# EAGLE design USBtoSPI (EAGLE 6.2)
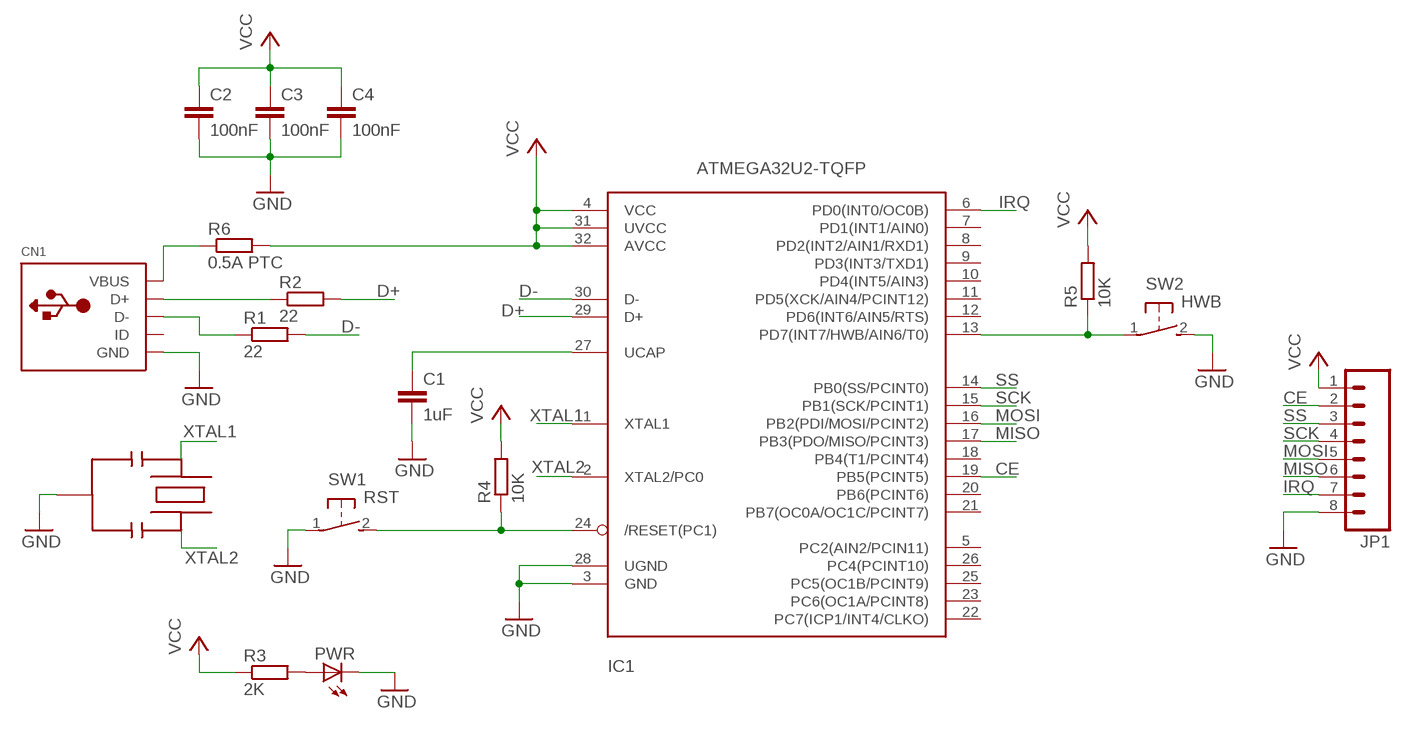
[diagram p0: schematic, sheet 1]

## Parts
C1  1uF  C-EUC0603  [C0603]
C2  100nF  C-EUC0603  [C0603]
C3  100nF  C-EUC0603  [C0603]
C4  100nF  C-EUC0603  [C0603]
CN1  USBMINIB  [USB-MINIB]
IC1  ATMEGA32U2-TQFP  [TQFP32-08]
JP1  M081X08  [1X08]
PWR  LEDCHIP-LED0603  [CHIP-LED0603]
R1  22  R-EU_R0603  [R0603]
R2  22  R-EU_R0603  [R0603]
R3  2K  R-EU_R0603  [R0603]
R4  10K  R-EU_R0603  [R0603]
R5  10K  R-EU_R0603  [R0603]
R6  0.5A PTC  R-EU_R1210  [R1210]
SW1  RST  SMD-TACT-3.9X2.9  [SMD-TACT-3.9X2.9]
SW2  HWB  SMD-TACT-3.9X2.9  [SMD-TACT-3.9X2.9]
U$1  SMDRESONATORPBRC-H  [SMDRESONATOR]

## Nets
CE: IC1.19(PB5(PCINT5)) JP1.2
D+: IC1.29(D+) R2.2
D-: IC1.30(D-) R1.2
GND: C1.2 C2.2 C3.2 C4.2 CN1.GND IC1.3(GND) IC1.28(UGND) JP1.8 PWR.C SW1.1 SW2.2 U$1.P$1
IRQ: IC1.6(PD0(INT0/OC0B)) JP1.7
MISO: IC1.17(PB3(PDO/MISO/PCINT3)) JP1.6
MOSI: IC1.16(PB2(PDI/MOSI/PCINT2)) JP1.5
N$1: CN1.D- R1.1
N$2: CN1.D+ R2.1
N$3: C1.1 IC1.27(UCAP)
N$4: IC1.24(/RESET(PC1)) R4.1 SW1.2
N$5: IC1.13(PD7(INT7/HWB/AIN6/T0)) R5.1 SW2.1
N$6: PWR.A R3.2
N$7: CN1.VBUS R6.1
SCK: IC1.15(PB1(SCK/PCINT1)) JP1.4
SS: IC1.14(PB0(SS/PCINT0)) JP1.3
VCC: C2.1 C3.1 C4.1 IC1.4(VCC) IC1.31(UVCC) IC1.32(AVCC) JP1.1 R3.1 R4.2 R5.2 R6.2
XTAL1: IC1.1(XTAL1) U$1.P$2
XTAL2: IC1.2(XTAL2/PC0) U$1.P$3
Unconnected: CN1.ID IC1.5(PC2(AIN2/PCIN11)) IC1.7(PD1(INT1/AIN0)) IC1.8(PD2(INT2/AIN1/RXD1)) IC1.9(PD3(INT3/TXD1)) IC1.10(PD4(INT5/AIN3)) IC1.11(PD5(XCK/AIN4/PCINT12)) IC1.12(PD6(INT6/AIN5/RTS)) IC1.18(PB4(T1/PCINT4)) IC1.20(PB6(PCINT6)) IC1.21(PB7(OC0A/OC1C/PCINT7)) IC1.22(PC7(ICP1/INT4/CLKO)) IC1.23(PC6(OC1A/PCINT8)) IC1.25(PC5(OC1B/PCINT9)) IC1.26(PC4(PCINT10))

## Library data of the parts
C1-C4 = resistor:C-EU: CAPACITOR, European symbol
CN1 = adafruit:USB: USB Connectors USBMINIB - Surface Mount Female Mini-B USB Connector 4UConnector: 06564 By microbuilder.eu Thru-hole RA Female Mini-B USB Connector 4UConnector: 18732 By ladyada.net
IC1 = adafruit:ATMEGA32U2: ATmega32u2 Pin compatible with the atmega8u2, atmega16u2 and atmega32u2 8, 16 or 32 K flash, 1K RAM, 512b EEPROM 8 bit and 16 bit timer (5 PWM total) UART, SPI (no I2C!) USB with 4 endpoints, LUFA compatible 22 I/O lines, analog comparator (no ADC!) Comes with DFU bootloader burned in!
JP1 = SparkFun-Connectors:M08: Header 8 Standard 8-pin 0.1" header. Use with straight break away headers (SKU : PRT-00116), right angle break away headers (PRT-00553), swiss pins (PRT-00743), machine pins (PRT-00117), and female headers (PRT-00115).
PWR = led:LED: LED OSRAM: - CHIPLED LG R971, LG N971, LY N971, LG Q971, LY Q971, LO R971, LY R971 LH N974, LH R974 LS Q976, LO Q976, LY Q976 LO Q996 - Hyper CHIPLED LW Q18S LB Q993, LB Q99A, LB R99A - SideLED LS A670, LO A670, LY A670, LG A670, LP A670 LB A673, LV A673, LT A673, LW A673 LH A674 LY A675 LS A676, LA A676, LO A676, LY A676, LW A676 LS A679, LY A679, LG A679 - Hyper Micro SIDELED® LS Y876, LA Y876, LO Y876, LY Y876 LT Y87S - SmartLED LW L88C, LW L88S LB L89C, LB L89S, LG L890 LS L89K, LO L89K, LY L89K LS L896, LA L896, LO L896, LY L896 - TOPLED LS T670, LO T670, LY T670, LG T670, LP T670 LSG T670, LSP T670, LSY T670, LOP T670, LYG T670 LG T671, LOG T671, LSG T671 LB T673, LV T673, LT T673, LW T673 LH T674 LS T676, LA T676, LO T676, LY T676, LB T676, LH T676, LSB T676, LW T676 LB T67C, LV T67C, LT T67C, LS T67K, LO T67K, LY T67K, LW E67C LS E67B, LA E67B, LO E67B, LY E67B, LB E67C, LV E67C, LT E67C LW T67C LS T679, LY T679, LG T679 LS T770, LO T770, LY T770, LG T770, LP T770 LB T773, LV T773, LT T773, LW T773 LH T774 LS E675, LA E675, LY E675, LS T675 LS T776, LA T776, LO T776, LY T776, LB T776 LHGB T686 LT T68C, LB T68C - Hyper Mini TOPLED® LB M676 - Mini TOPLED Santana® LG M470 LS M47K, LO M47K, LY M47K Source: http://www.osram.convergy.de LUXEON: - LUMILED® LXK2-PW12-R00, LXK2-PW12-S00, LXK2-PW14-U00, LXK2-PW14-V00 LXK2-PM12-R00, LXK2-PM12-S00, LXK2-PM14-U00 LXK2-PE12-Q00, LXK2-PE12-R00, LXK2-PE12-S00, LXK2-PE14-T00, LXK2-PE14-U00 LXK2-PB12-K00, LXK2-PB12-L00, LXK2-PB12-M00, LXK2-PB14-N00, LXK2-PB14-P00, LXK2-PB14-Q00 LXK2-PR12-L00, LXK2-PR12-M00, LXK2-PR14-Q00, LXK2-PR14-R00 LXK2-PD12-Q00, LXK2-PD12-R00, LXK2-PD12-S00 LXK2-PH12-R00, LXK2-PH12-S00 LXK2-PL12-P00, LXK2-PL12-Q00, LXK2-PL12-R00 Source: www.luxeon.com KINGBRIGHT: KA-3528ASYC Source: www.kingbright.com
R1-R6 = resistor:R-EU_: RESISTOR, European symbol
SW1 SW2 = Erik:SMD-TACT-3.9X2.9: SMD Tactile switch 3.9x2.9 @ebay yayaya168
U$1 = karl:SMDRESONATOR

## Board
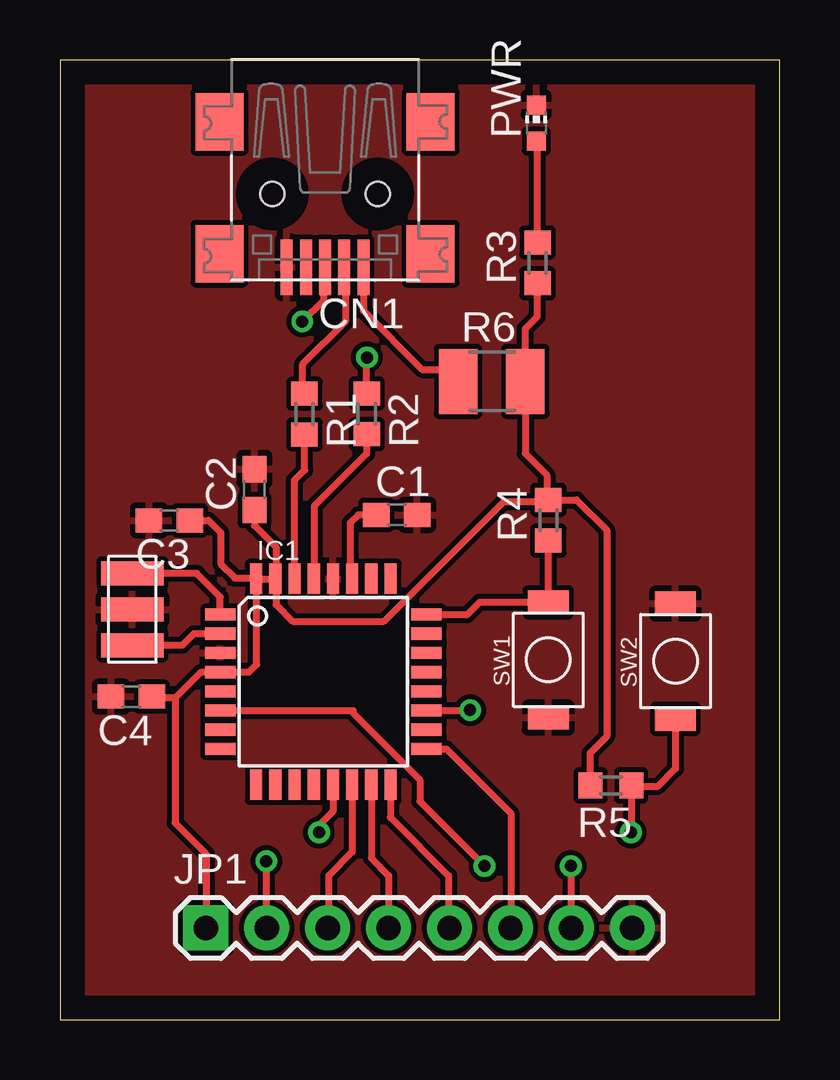
[diagram p1: board, top side]
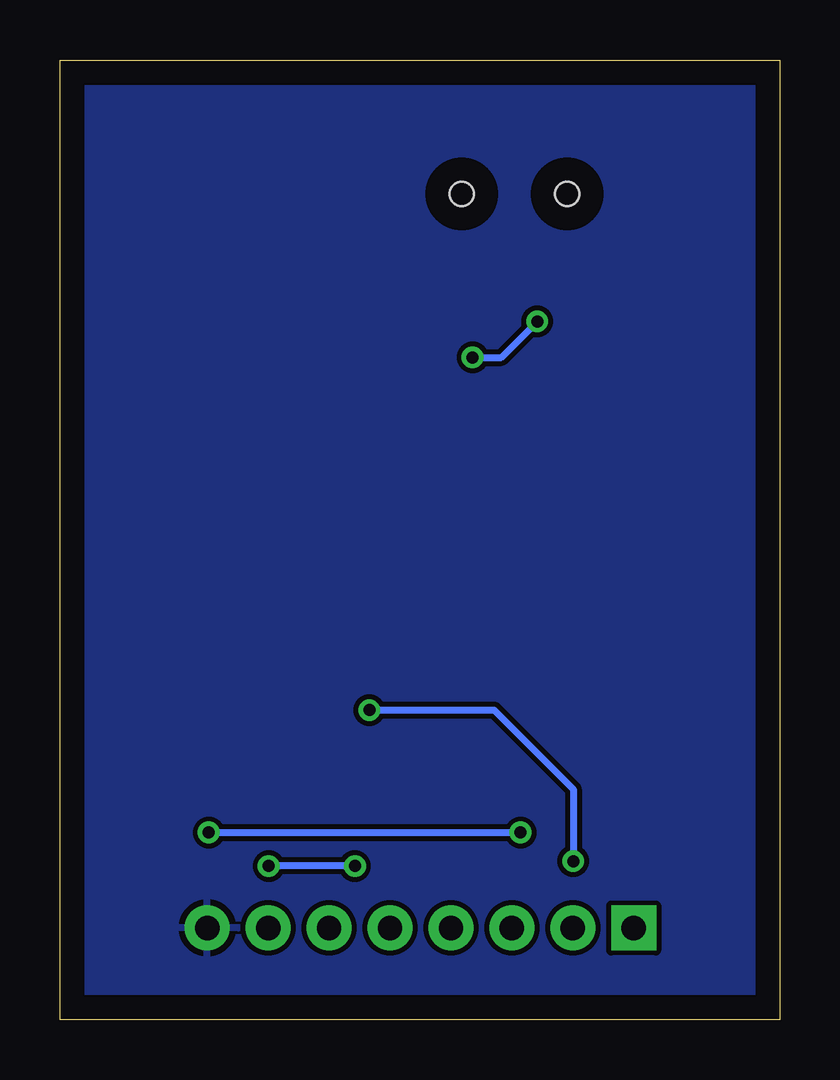
[diagram p2: board, bottom side, seen from below]

Size 30 x 40 mm. Coordinates in mm from the lower left corner, seen from the top.
Outline: 0,0 30,0 30,40 0,40 0,0
Copper layers (1*16): Top 0.035mm / dielectric 1.5mm / Bottom 0.035mm
Design rules: minimum track width 10mil, minimum drill 0.4mm, track to track 8mil, track to pad 8mil, pad to pad 8mil, via to via 8mil, smd to smd 8mil, copper to edge 40mil, drill to drill 8mil, minimum pad ring 10mil, minimum via ring 8mil, stop-mask expansion 4mil, vias tented up to drill 0mil, thermal gap 10mil

### Footprints (pad centres in the part's own frame; a part is rotated, then mirrored left to right if it is on the bottom)
C0603 = smd 1.1 x 1: 1 -0.85,0; 2 0.85,0
USB-MINIB = smd 0.5 x 2.308: D+ 0,4.064; D- -0.8,4.064; GND 1.6,4.064; ID 0.8,4.064; VBUS -1.6,4.064 | smd 2 x 2.4: GND1 -4.4,-2; GND2 -4.4,3.5; GND3 4.4,3.5; GND4 4.4,-2 | hole 1: -2.2,1; 2.2,1
TQFP32-08 = smd 1.27 x 0.508: 1 -4.293,2.8; 2 -4.293,2; 3 -4.293,1.2; 4 -4.293,0.4; 5 -4.293,-0.4; 6 -4.293,-1.2; 7 -4.293,-2; 8 -4.293,-2.8; 17 4.293,-2.8; 18 4.293,-2; 19 4.293,-1.2; 20 4.293,-0.4; 21 4.293,0.4; 22 4.293,1.2; 23 4.293,2; 24 4.293,2.8 | smd 0.508 x 1.27: 9 -2.8,-4.293; 10 -2,-4.293; 11 -1.2,-4.293; 12 -0.4,-4.293; 13 0.4,-4.293; 14 1.2,-4.293; 15 2,-4.293; 16 2.8,-4.293; 25 2.8,4.293; 26 2,4.293; 27 1.2,4.293; 28 0.4,4.293; 29 -0.4,4.293; 30 -1.2,4.293; 31 -2,4.293; 32 -2.8,4.293
1X08 = drill 1.016 pad 1.88 square: 1 0,0 | drill 1.016 pad 1.88: 2 2.54,0; 3 5.08,0; 4 7.62,0; 5 10.16,0; 6 12.7,0; 7 15.24,0; 8 17.78,0
CHIP-LED0603 = smd 0.8 x 0.8: A 0,-0.75; C 0,0.75
R0603 = smd 1 x 1.1: 1 -0.85,0; 2 0.85,0
R1210 = smd 1.6 x 2.7: 1 -1.4,0; 2 1.4,0
SMD-TACT-3.9X2.9 = smd 1 x 1.7: 1 -2.4,0; 2 2.4,0
SMDRESONATOR = smd 1 x 2.6: P$1 0,0; P$2 -1.5,0; P$3 1.5,0

### Placement (x,y rotation side)
C1  14.04,21.04 0 top
C2  8.11,22.09 90 top
C3  4.56,20.81 180 top
C4  2.98,13.46 180 top
CN1  11.05,35.42 180 top
IC1  10.98,14.08 0 top
JP1  6.08,3.82 0 top
PWR  19.86,37.37 0 top
R1  10.19,25.24 270 top
R2  12.79,25.25 270 top
R3  19.91,31.54 90 top
R4  20.36,20.81 90 top
R5  22.97,9.76 180 top
R6  18,26.6 0 top
SW1  20.36,14.99 90 top
SW2  25.66,14.94 90 top
U$1  3.02,17.1 270 top

### Tracks (layer width: path | path; a pad name or v marks a point on that pad's centre or on a via)
CE  (via drill 0.5)
  Top 0.3: IC1.19 17.08,12.88 v17.1,12.9 | v8.6,6.6 8.6,3.84 JP1.2
  Bottom 0.3: v17.1,12.9 11.9,12.9 8.6,9.6 v8.6,6.6
D+
  Top 0.3: R2.2 12.79,23.59 10.6,21.4 10.6,18.39 IC1.29
D-
  Top 0.3: IC1.30 9.78,22.48 10.2,22.9 R1.2
GND
  pour Top: -1,41 -1,-1 31,-1 31,41
  pour Bottom: 0,40 0,0 30,0 30,40
IRQ  (via drill 0.5)
  Top 0.3: IC1.6 12.22,12.88 12.22,12.78 15,10 15,9.1 v17.7,6.4 | v21.3,6.4 21.3,3.84 JP1.7
  Bottom 0.3: v17.7,6.4 v21.3,6.4
MISO
  Top 0.3: IC1.17 16.12,11.28 18.8,8.6 18.8,3.84 JP1.6
MOSI
  Top 0.3: IC1.16 13.78,8.42 16.2,6 16.2,3.86 JP1.5
N$1
  Top 0.3: CN1.D- 11.9,31.31 11.9,29.1 10.1,27.3 10.1,26.18 R1.1
N$2  (via drill 0.5)
  Top 0.3: R2.1 v12.79,27.59 v12.8,27.6 | v10.1,29.1 11,30 11,31.31 CN1.D+
  Bottom 0.3: v12.8,27.6 11.6,27.6 v10.1,29.1
N$3
  Top 0.3: C1.1 12.44,21.04 12.1,20.7 12.1,18.45 IC1.27
N$4
  Top 0.3: IC1.24 16.98,16.88 17.5,17.4 SW1.2 R4.1
N$5  (via drill 0.5)
  Top 0.3: SW2.1 25.66,10.46 24.9,9.7 23.88,9.7 R5.1 23.82,7.82 v23.8,7.8 | v10.8,7.8 10.8,8.1 11.4,8.7 11.4,9.77 IC1.13
  Bottom 0.3: v23.8,7.8 v10.8,7.8
N$6
  Top 0.3: R3.2 19.91,36.57 PWR.A
N$7
  Top 0.3: CN1.VBUS 12.65,29.55 15.1,27.1 16.1,27.1 R6.1
SCK
  Top 0.3: IC1.15 12.98,6.72 13.7,6 JP1.4
SS
  Top 0.3: IC1.14 12.18,6.98 11.2,6 11.2,3.86 JP1.3
VCC
  Top 0.3: IC1.32 8.2,18.35 8.2,14.8 7.88,14.48 IC1.4 6.67,14.46 5.86,14.46 4.8,13.4 | IC1.32 IC1.31 9,18.39 | R3.1 19.9,29.3 19.4,28.8 R6.2 19.4,23.6 20.3,22.7 20.3,21.72 R4.2 | 4.8,13.4 3.89,13.4 C4.1 | C3.1 6.19,20.81 6.7,20.3 6.7,19 7.3,18.4 8.15,18.4 IC1.32 | C2.1 8.11,20.59 9,19.7 9,18.39 | 4.8,13.4 4.8,8.2 6.1,6.9 6.1,3.84 JP1.1 | R4.2 21.54,21.66 22.8,20.4 22.8,11.8 22.1,11.1 22.1,9.78 R5.2 | 9,18.39 9,17.3 9.7,16.6 13.5,16.6 18.5,21.6 20.3,21.6 R4.2
XTAL1
  Top 0.3: IC1.1 6.69,17.61 5.7,18.6 U$1.P$2
XTAL2
  Top 0.3: IC1.2 5.58,16.08 5.1,15.6 U$1.P$3